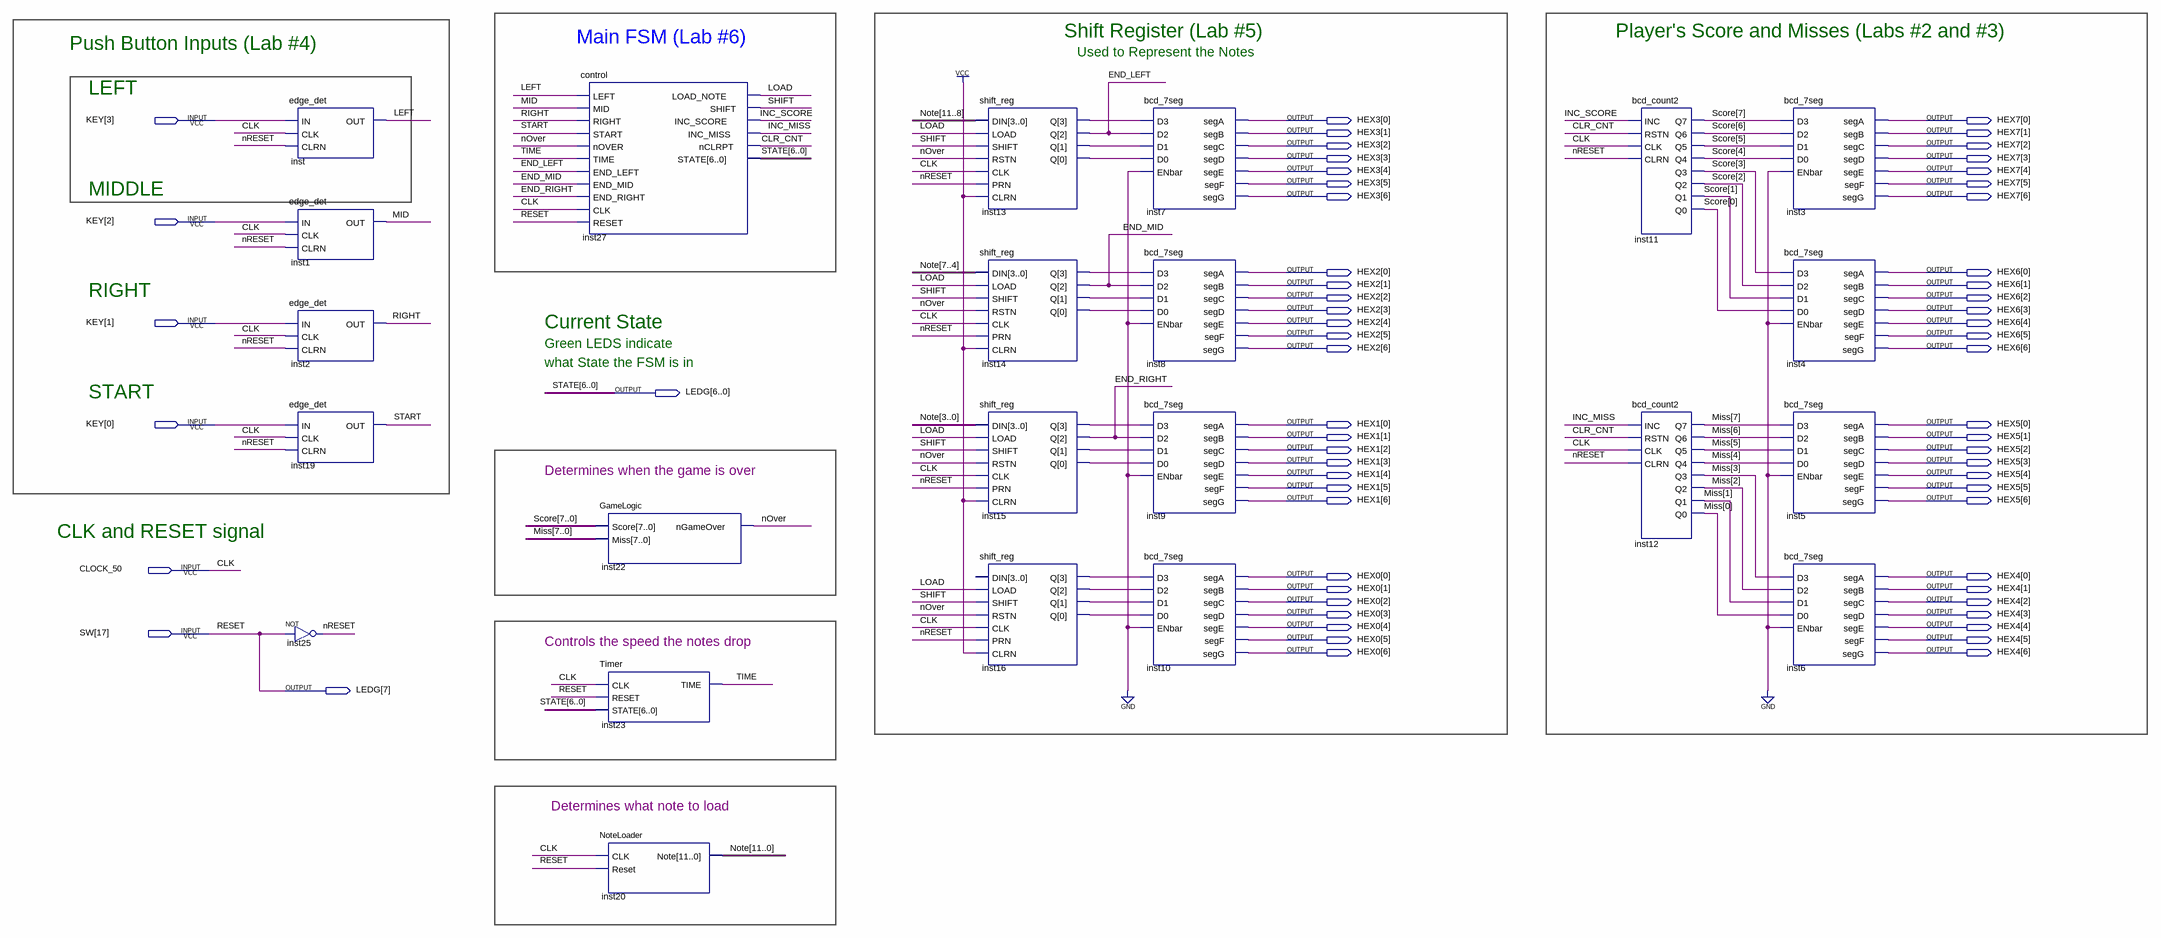
[diagram p0: schematic sheet]
// Quartus schematic Lab6_top_level.bdf as structural Verilog: 23 symbols, 64 pins
module Lab6_top_level (
  input  [3:0] KEY,
  input  CLOCK_50,
  input  [17:17] SW,
  output [6:0] HEX3,
  output [6:0] HEX7,
  output [6:0] HEX2,
  output [6:0] HEX6,
  output [7:0] LEDG,
  output [6:0] HEX1,
  output [6:0] HEX5,
  output [6:0] HEX0,
  output [6:0] HEX4
);

  wire CLR_CNT, END_LEFT, END_MID, END_RIGHT, INC_MISS, INC_SCORE, inst13_q, inst13_q_2, inst13_q_3,
       inst14_q, inst14_q_2, inst14_q_3, inst15_q, inst15_q_2, inst15_q_3, inst16_q, inst16_q_2, inst16_q_3,
       inst16_q_4, LEFT, LOAD, MID, nOver, nRESET, RIGHT, SHIFT, START, TIME;
  wire [7:0] Miss, Score;
  wire [11:0] Note;

  edge_det inst (.IN(KEY[3]), .CLK(CLOCK_50), .CLRN(nRESET), .OUT(LEFT));
  edge_det inst1 (.IN(KEY[2]), .CLK(CLOCK_50), .CLRN(nRESET), .OUT(MID));
  edge_det inst2 (.IN(KEY[1]), .CLK(CLOCK_50), .CLRN(nRESET), .OUT(RIGHT));
  edge_det inst19 (.IN(KEY[0]), .CLK(CLOCK_50), .CLRN(nRESET), .OUT(START));
  not inst25 (nRESET, SW[17]);
  control inst27 (
    .LEFT(LEFT), .MID(MID), .RIGHT(RIGHT), .START(START), .nOVER(nOver), .TIME(TIME), .END_LEFT(END_LEFT),
    .END_MID(END_MID), .END_RIGHT(END_RIGHT), .CLK(CLOCK_50), .RESET(SW[17]), .LOAD_NOTE(LOAD),
    .SHIFT(SHIFT), .INC_SCORE(INC_SCORE), .INC_MISS(INC_MISS), .nCLRPT(CLR_CNT), .STATE(LEDG[6:0]));
  GameLogic inst22 (.Score(Score), .Miss(Miss), .nGameOver(nOver));
  Timer inst23 (.CLK(CLOCK_50), .RESET(SW[17]), .STATE(LEDG[6:0]), .TIME(TIME));
  NoteLoader inst20 (.CLK(CLOCK_50), .Reset(SW[17]), .Note(Note));
  shift_reg inst13 (
    .DIN(Note[11:8]), .LOAD(LOAD), .SHIFT(SHIFT), .RSTN(nOver), .CLK(CLOCK_50), .PRN(nRESET), .CLRN(1'b1),
    .Q({inst13_q, END_LEFT, inst13_q_2, inst13_q_3}));
  shift_reg inst14 (
    .DIN(Note[7:4]), .LOAD(LOAD), .SHIFT(SHIFT), .RSTN(nOver), .CLK(CLOCK_50), .PRN(nRESET), .CLRN(1'b1),
    .Q({inst14_q, END_MID, inst14_q_2, inst14_q_3}));
  shift_reg inst15 (
    .DIN(Note[3:0]), .LOAD(LOAD), .SHIFT(SHIFT), .RSTN(nOver), .CLK(CLOCK_50), .PRN(nRESET), .CLRN(1'b1),
    .Q({inst15_q, END_RIGHT, inst15_q_2, inst15_q_3}));
  shift_reg inst16 (
    .LOAD(LOAD), .SHIFT(SHIFT), .RSTN(nOver), .CLK(CLOCK_50), .PRN(nRESET), .CLRN(1'b1),
    .Q({inst16_q, inst16_q_2, inst16_q_3, inst16_q_4}));  // open: DIN
  bcd_7seg inst7 (
    .D3(inst13_q), .D2(END_LEFT), .D1(inst13_q_2), .D0(inst13_q_3), .ENbar(1'b0), .segA(HEX3[0]),
    .segB(HEX3[1]), .segC(HEX3[2]), .segD(HEX3[3]), .segE(HEX3[4]), .segF(HEX3[5]), .segG(HEX3[6]));
  bcd_7seg inst8 (
    .D3(inst14_q), .D2(END_MID), .D1(inst14_q_2), .D0(inst14_q_3), .ENbar(1'b0), .segA(HEX2[0]),
    .segB(HEX2[1]), .segC(HEX2[2]), .segD(HEX2[3]), .segE(HEX2[4]), .segF(HEX2[5]), .segG(HEX2[6]));
  bcd_7seg inst9 (
    .D3(inst15_q), .D2(END_RIGHT), .D1(inst15_q_2), .D0(inst15_q_3), .ENbar(1'b0), .segA(HEX1[0]),
    .segB(HEX1[1]), .segC(HEX1[2]), .segD(HEX1[3]), .segE(HEX1[4]), .segF(HEX1[5]), .segG(HEX1[6]));
  bcd_7seg inst10 (
    .D3(inst16_q), .D2(inst16_q_2), .D1(inst16_q_3), .D0(inst16_q_4), .ENbar(1'b0), .segA(HEX0[0]),
    .segB(HEX0[1]), .segC(HEX0[2]), .segD(HEX0[3]), .segE(HEX0[4]), .segF(HEX0[5]), .segG(HEX0[6]));
  bcd_count2 inst11 (
    .INC(INC_SCORE), .RSTN(CLR_CNT), .CLK(CLOCK_50), .CLRN(nRESET), .Q7(Score[7]), .Q6(Score[6]),
    .Q5(Score[5]), .Q4(Score[4]), .Q3(Score[3]), .Q2(Score[2]), .Q1(Score[1]), .Q0(Score[0]));
  bcd_count2 inst12 (
    .INC(INC_MISS), .RSTN(CLR_CNT), .CLK(CLOCK_50), .CLRN(nRESET), .Q7(Miss[7]), .Q6(Miss[6]), .Q5(Miss[5]),
    .Q4(Miss[4]), .Q3(Miss[3]), .Q2(Miss[2]), .Q1(Miss[1]), .Q0(Miss[0]));
  bcd_7seg inst3 (
    .D3(Score[7]), .D2(Score[6]), .D1(Score[5]), .D0(Score[4]), .ENbar(1'b0), .segA(HEX7[0]), .segB(HEX7[1]),
    .segC(HEX7[2]), .segD(HEX7[3]), .segE(HEX7[4]), .segF(HEX7[5]), .segG(HEX7[6]));
  bcd_7seg inst4 (
    .D3(Score[3]), .D2(Score[2]), .D1(Score[1]), .D0(Score[0]), .ENbar(1'b0), .segA(HEX6[0]), .segB(HEX6[1]),
    .segC(HEX6[2]), .segD(HEX6[3]), .segE(HEX6[4]), .segF(HEX6[5]), .segG(HEX6[6]));
  bcd_7seg inst5 (
    .D3(Miss[7]), .D2(Miss[6]), .D1(Miss[5]), .D0(Miss[4]), .ENbar(1'b0), .segA(HEX5[0]), .segB(HEX5[1]),
    .segC(HEX5[2]), .segD(HEX5[3]), .segE(HEX5[4]), .segF(HEX5[5]), .segG(HEX5[6]));
  bcd_7seg inst6 (
    .D3(Miss[3]), .D2(Miss[2]), .D1(Miss[1]), .D0(Miss[0]), .ENbar(1'b0), .segA(HEX4[0]), .segB(HEX4[1]),
    .segC(HEX4[2]), .segD(HEX4[3]), .segE(HEX4[4]), .segF(HEX4[5]), .segG(HEX4[6]));

  assign LEDG[7] = SW[17];

  // Other names for the same wires on the sheet: CLK = CLOCK_50; RESET = SW[17]; STATE[6:0] = LEDG[6:0]

  // Notes on the sheet:
  //   Shift Register (Lab #5)
  //   Player's Score and Misses (Labs #2 and #3)
  //   Main FSM (Lab #6)
  //   Push Button Inputs (Lab #4)
  //   Used to Represent the Notes
  //   LEFT
  //   MIDDLE
  //   RIGHT
  //   Current State
  //   Green LEDS indicate
  //   what State the FSM is in
  //   START
  //   Determines when the game is over
  //   CLK and RESET signal
  //   Controls the speed the notes drop
  //   Determines what note to load
endmodule
